# EAGLE schematic Controllerboard (EAGLE 6.5.0)
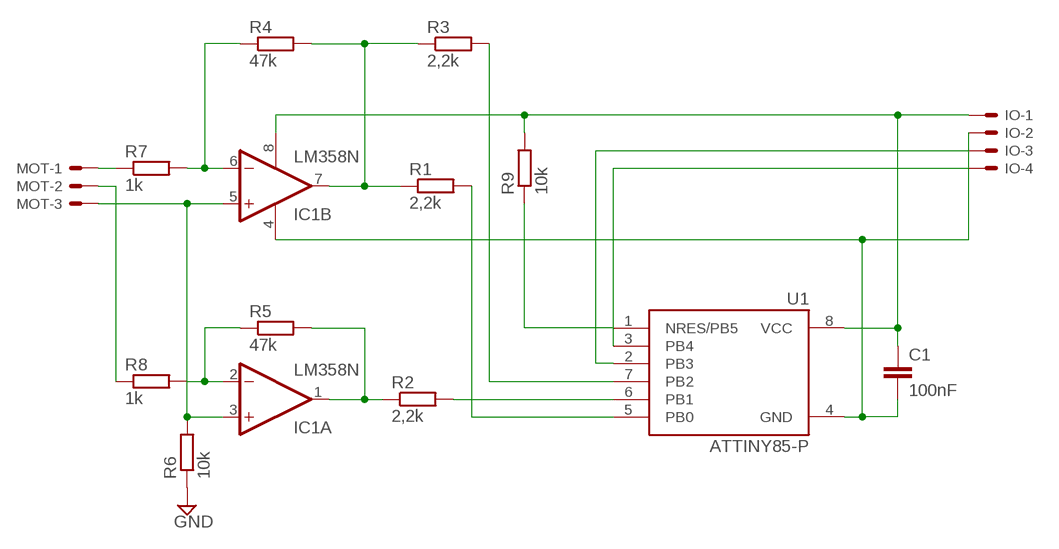
[diagram p0: schematic, sheet 1]

## Parts
C1  100nF  C-EU025-024X044  [C025-024X044]
IC1  LM358N  [DIL08]
IO  KK-156-4  [KK-156-4]
MOT  KK-156-3  [KK-156-3]
R1  2,2k  R-EU_0204/7  [0204/7]
R2  2,2k  R-EU_0204/7  [0204/7]
R3  2,2k  R-EU_0204/7  [0204/7]
R4  47k  R-EU_0204/7  [0204/7]
R5  47k  R-EU_0204/7  [0204/7]
R6  10k  R-EU_0204/7  [0204/7]
R7  1k  R-EU_0204/7  [0204/7]
R8  1k  R-EU_0204/7  [0204/7]
R9  10k  R-EU_0204/7  [0204/7]
U1  ATTINY85-P  [PDIP08_300MIL]

## Nets
+5V: C1.1 IC1.8(P:V+) IO.1 R9.2 U1.8(VCC)
GND: C1.2 IC1.4(P:V-) IO.2 R6.1 U1.4(GND)
N$1: MOT.1 R7.1
N$2: IC1.6(B:-IN) R4.1 R7.2
N$3: MOT.2 R8.1
N$4: IC1.2(A:-IN) R5.1 R8.2
N$5: IC1.3(A:+IN) IC1.5(B:+IN) MOT.3 R6.2
N$6: IC1.7(B:OUT) R1.1 R3.1 R4.2
N$7: IC1.1(A:OUT) R2.1 R5.2
N$8: R2.2 U1.6(PB1)
N$9: R1.2 U1.5(PB0)
N$10: R9.1 U1.1(NRES/PB5)
N$11: R3.2 U1.7(PB2)
N$12: IO.4 U1.3(PB4)
N$13: IO.3 U1.2(PB3)

## Library data of the parts
C1 = resistor:C-EU: CAPACITOR, European symbol
IC1 = linear:LM358: OP AMP also LM158; LM258; LM2904 Source: http://cache.national.com/ds/LM/LM158.pdf
IO = con-molex:KK-156-4: KK 156 HEADER Source: http://www.molex.com/pdm_docs/sd/026604100_sd.pdf; OC_FARNELL: unknown; OC_NEWARK: unknown
MOT = con-molex:KK-156-3: KK 156 HEADER Source: http://www.molex.com/pdm_docs/sd/026604100_sd.pdf; OC_FARNELL: unknown; OC_NEWARK: unknown
R1-R8 = resistor:R-EU_: RESISTOR, European symbol
R9 = rcl:R-EU_: RESISTOR, European symbol
U1 = _hhn_attiny25_45_85:ATTINY85*: ATMEL ATtiny 85 Packages: P = PDIP 08 30mil S = SOIC 08 EIAJ 208mil Technologies Note: for complete ordering code (temp. range, finish, tape&reel etc.) see www.atmel.com • Supply Voltage: V = (1.8…5.5)V | [blank] = (2.7…5.5)V • Speed: 10 = 10 MHz | 20 = 20 MHz Author: Dipl.-Ing. FH Rainer Bayer HHN Hochschule Heilbronn (Heilbronn University), rainer.bayer@hs-heilbronn.de Ingenieurbüro ing-rb, mail@ing-rb.de